# Altium schematic sheet Sensor.SchDoc
size A4
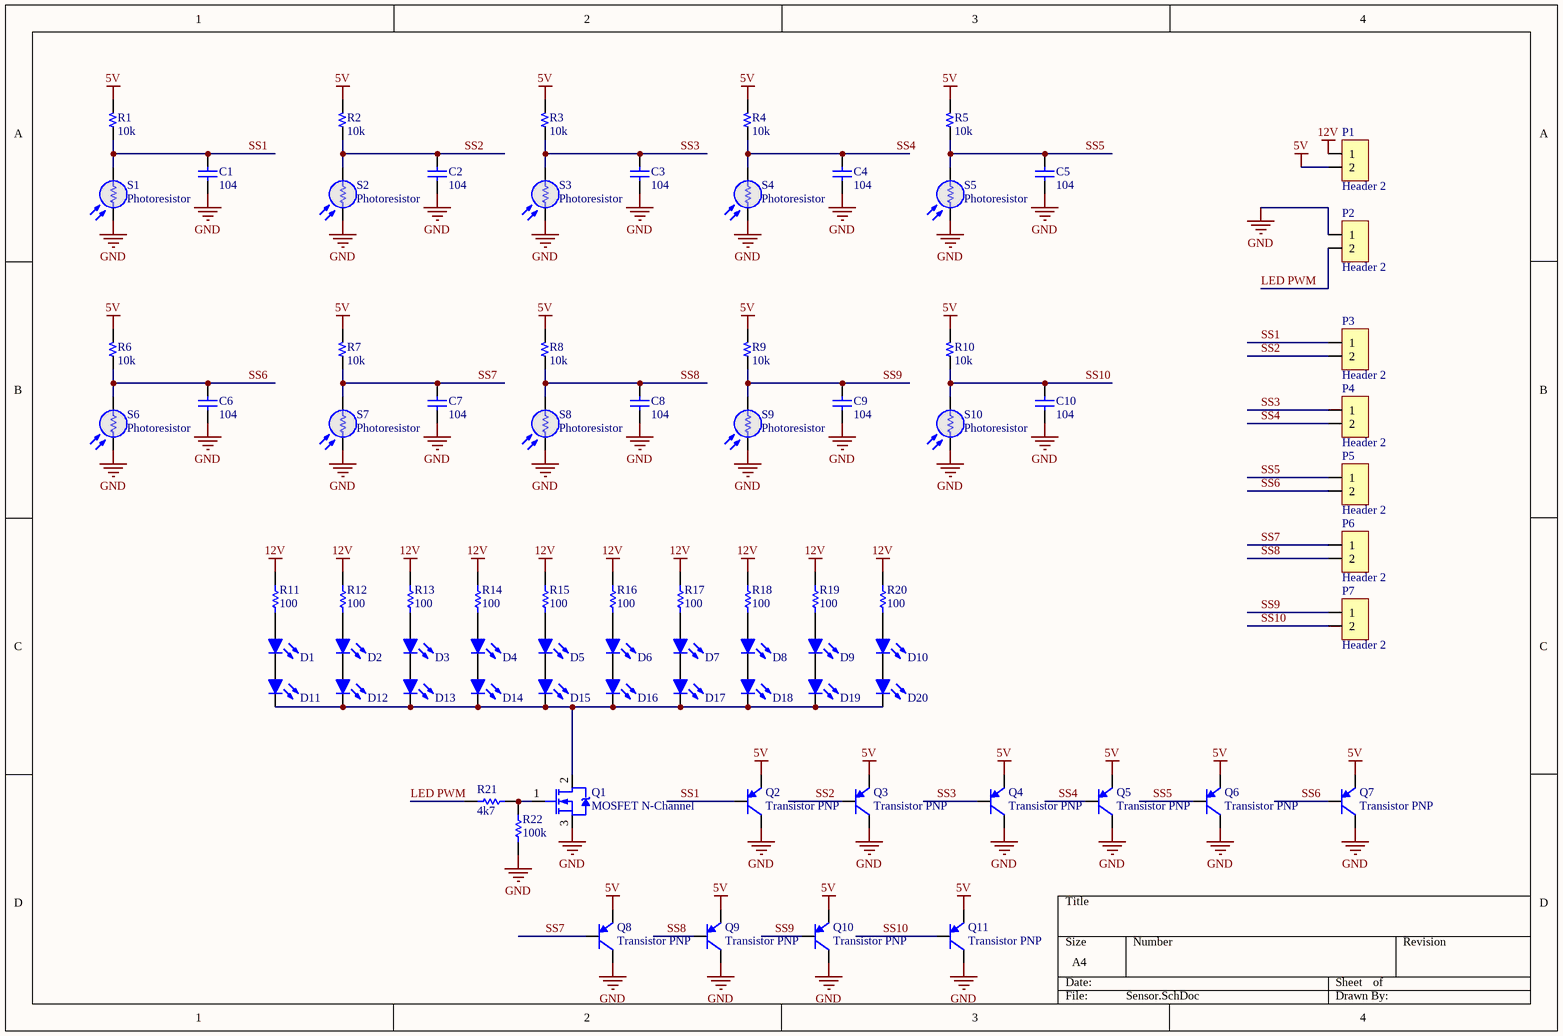
[diagram p0: Sensor.SchDoc]

## Parts
C1  104  [C 0805]
C2  104  [C 0805]
C3  104  [C 0805]
C4  104  [C 0805]
C5  104  [C 0805]
C6  104  [C 0805]
C7  104  [C 0805]
C8  104  [C 0805]
C9  104  [C 0805]
C10  104  [C 0805]
D1  Led  [LED 5MM - WHITE]  (value not drawn)
D2  Led  [LED 5MM - WHITE]  (value not drawn)
D3  Led  [LED 5MM - WHITE]  (value not drawn)
D4  Led  [LED 5MM - WHITE]  (value not drawn)
D5  Led  [LED 5MM - WHITE]  (value not drawn)
D6  Led  [LED 5MM - WHITE]  (value not drawn)
D7  Led  [LED 5MM - WHITE]  (value not drawn)
D8  Led  [LED 5MM - WHITE]  (value not drawn)
D9  Led  [LED 5MM - WHITE]  (value not drawn)
D10  Led  [LED 5MM - WHITE]  (value not drawn)
D11  Led  [LED 5MM - WHITE]  (value not drawn)
D12  Led  [LED 5MM - WHITE]  (value not drawn)
D13  Led  [LED 5MM - WHITE]  (value not drawn)
D14  Led  [LED 5MM - WHITE]  (value not drawn)
D15  Led  [LED 5MM - WHITE]  (value not drawn)
D16  Led  [LED 5MM - WHITE]  (value not drawn)
D17  Led  [LED 5MM - WHITE]  (value not drawn)
D18  Led  [LED 5MM - WHITE]  (value not drawn)
D19  Led  [LED 5MM - WHITE]  (value not drawn)
D20  Led  [LED 5MM - WHITE]  (value not drawn)
P1  Header 2  [HDR Domino 2 - 5MM]
P2  Header 2  [HDR Domino 2 - 5MM]
P3  Header 2  [HDR Domino 2 - 5MM]
P4  Header 2  [HDR Domino 2 - 5MM]
P5  Header 2  [HDR Domino 2 - 5MM]
P6  Header 2  [HDR Domino 2 - 5MM]
P7  Header 2  [HDR Domino 2 - 5MM]
Q1  MOSFET N-Channel  [TO-252 (DPAK)]
Q2  Transistor PNP  [TO-92]
Q3  Transistor PNP  [TO-92]
Q4  Transistor PNP  [TO-92]
Q5  Transistor PNP  [TO-92]
Q6  Transistor PNP  [TO-92]
Q7  Transistor PNP  [TO-92]
Q8  Transistor PNP  [TO-92]
Q9  Transistor PNP  [TO-92]
Q10  Transistor PNP  [TO-92]
Q11  Transistor PNP  [TO-92]
R1  10k  [R 0805]
R2  10k  [R 0805]
R3  10k  [R 0805]
R4  10k  [R 0805]
R5  10k  [R 0805]
R6  10k  [R 0805]
R7  10k  [R 0805]
R8  10k  [R 0805]
R9  10k  [R 0805]
R10  10k  [R 0805]
R11  100  [R 0805 (2012)]
R12  100  [R 0805 (2012)]
R13  100  [R 0805 (2012)]
R14  100  [R 0805 (2012)]
R15  100  [R 0805 (2012)]
R16  100  [R 0805 (2012)]
R17  100  [R 0805 (2012)]
R18  100  [R 0805 (2012)]
R19  100  [R 0805 (2012)]
R20  100  [R 0805 (2012)]
R21  4k7  [R 0805 (2012)]
R22  100k  [R 0805 (2012)]
S1  Photoresistor  [PHOTOCELL/12mm]
S2  Photoresistor  [PHOTOCELL/12mm]
S3  Photoresistor  [PHOTOCELL/12mm]
S4  Photoresistor  [PHOTOCELL/12mm]
S5  Photoresistor  [PHOTOCELL/12mm]
S6  Photoresistor  [PHOTOCELL/12mm]
S7  Photoresistor  [PHOTOCELL/12mm]
S8  Photoresistor  [PHOTOCELL/12mm]
S9  Photoresistor  [PHOTOCELL/12mm]
S10  Photoresistor  [PHOTOCELL/12mm]

## Nets
5V: P1.2 Q2.2(E) Q3.2(E) Q4.2(E) Q5.2(E) Q6.2(E) Q7.2(E) Q8.2(E) Q9.2(E) Q10.2(E) Q11.2(E) R1.2 R2.2 R3.2 R4.2 R5.2 R6.2 R7.2 R8.2 R9.2 R10.2
12V: P1.1 R11.2 R12.2 R13.2 R14.2 R15.2 R16.2 R17.2 R18.2 R19.2 R20.2
GND: C1.2 C2.2 C3.2 C4.2 C5.2 C6.2 C7.2 C8.2 C9.2 C10.2 P2.1 Q1.3(S) Q2.3(C) Q3.3(C) Q4.3(C) Q5.3(C) Q6.3(C) Q7.3(C) Q8.3(C) Q9.3(C) Q10.3(C) Q11.3(C) R22.1 S1.1 S2.1 S3.1 S4.1 S5.1 S6.1 S7.1 S8.1 S9.1 S10.1
LED PWM: P2.2 R21.2
SS1: C1.1 P3.1 Q2.1(B) R1.1 S1.2
SS2: C2.1 P3.2 Q3.1(B) R2.1 S2.2
SS3: C3.1 P4.1 Q4.1(B) R3.1 S3.2
SS4: C4.1 P4.2 Q5.1(B) R4.1 S4.2
SS5: C5.1 P5.1 Q6.1(B) R5.1 S5.2
SS6: C6.1 P5.2 Q7.1(B) R6.1 S6.2
SS7: C7.1 P6.1 Q8.1(B) R7.1 S7.2
SS8: C8.1 P6.2 Q9.1(B) R8.1 S8.2
SS9: C9.1 P7.1 Q10.1(B) R9.1 S9.2
SS10: C10.1 P7.2 Q11.1(B) R10.1 S10.2
NetD1_1: D1.1(A) R11.1
NetD1_2: D1.2(K) D11.1(A)
NetD2_1: D2.1(A) R12.1
NetD2_2: D2.2(K) D12.1(A)
NetD3_1: D3.1(A) R13.1
NetD3_2: D3.2(K) D13.1(A)
NetD4_1: D4.1(A) R14.1
NetD4_2: D4.2(K) D14.1(A)
NetD5_1: D5.1(A) R15.1
NetD5_2: D5.2(K) D15.1(A)
NetD6_1: D6.1(A) R16.1
NetD6_2: D6.2(K) D16.1(A)
NetD7_1: D7.1(A) R17.1
NetD7_2: D7.2(K) D17.1(A)
NetD8_1: D8.1(A) R18.1
NetD8_2: D8.2(K) D18.1(A)
NetD9_1: D9.1(A) R19.1
NetD9_2: D9.2(K) D19.1(A)
NetD10_1: D10.1(A) R20.1
NetD10_2: D10.2(K) D20.1(A)
NetD11_2: D11.2(K) D12.2(K) D13.2(K) D14.2(K) D15.2(K) D16.2(K) D17.2(K) D18.2(K) D19.2(K) D20.2(K) Q1.2(D)
NetQ1_1: Q1.1(G) R21.1 R22.2

## Library data of the parts
C1-C10 = Capacitor NP: Capacitor non-pol
D1-D20 = Led: Typical LED
P1-P7 = Header 2: Header, 2-Pin; LatestRevisionDate: 17-Jul-2002; LatestRevisionNote: Re-released for DXP Platform.; Publisher: Altium Limited
Q2-Q11 = Transistor PNP: PNP Bipolar Transistor; pin to pad: 1>3 2>1 3>2
R1-R22 = Resistor
  R11-R22: Published: 8-Jun-2000; LatestRevisionDate: 17-Jul-2002; LatestRevisionNote: Re-released for DXP Platform.; PackageReference: AXIAL-0.3; Publisher: Altium Limited
S1-S10 = Photoresistor: Light dependent resistors